# EAGLE design quad_sensor_adapter (EAGLE 9.0.0)
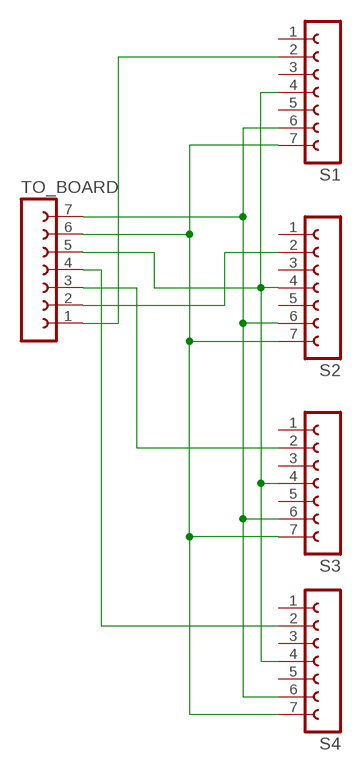
[diagram p0: schematic, sheet 1]

## Parts
S1  FE07-1  [FE07]
S2  FE07-1  [FE07]
S3  FE07-1  [FE07]
S4  FE07-1  [FE07]
TO_BOARD  FE07-1  [FE07]

## Nets
GRND: S1.7 S2.7 S3.7 S4.7 TO_BOARD.6
N$1: S4.2 TO_BOARD.4
PWR: S1.6 S2.6 S3.6 S4.6 TO_BOARD.7
RX1: S1.2 TO_BOARD.1
RX2: S2.2 TO_BOARD.2
RX3: S3.2 TO_BOARD.3
S3: S1.4 S2.4 S3.4 S4.4 TO_BOARD.5
Unconnected: S1.1 S1.3 S1.5 S2.1 S2.3 S2.5 S3.1 S3.3 S3.5 S4.1 S4.3 S4.5

## Library data of the parts
S1-S4 TO_BOARD = con-lsta:FE07-1: FEMALE HEADER; OC_FARNELL: unknown; OC_NEWARK: unknown

## Board
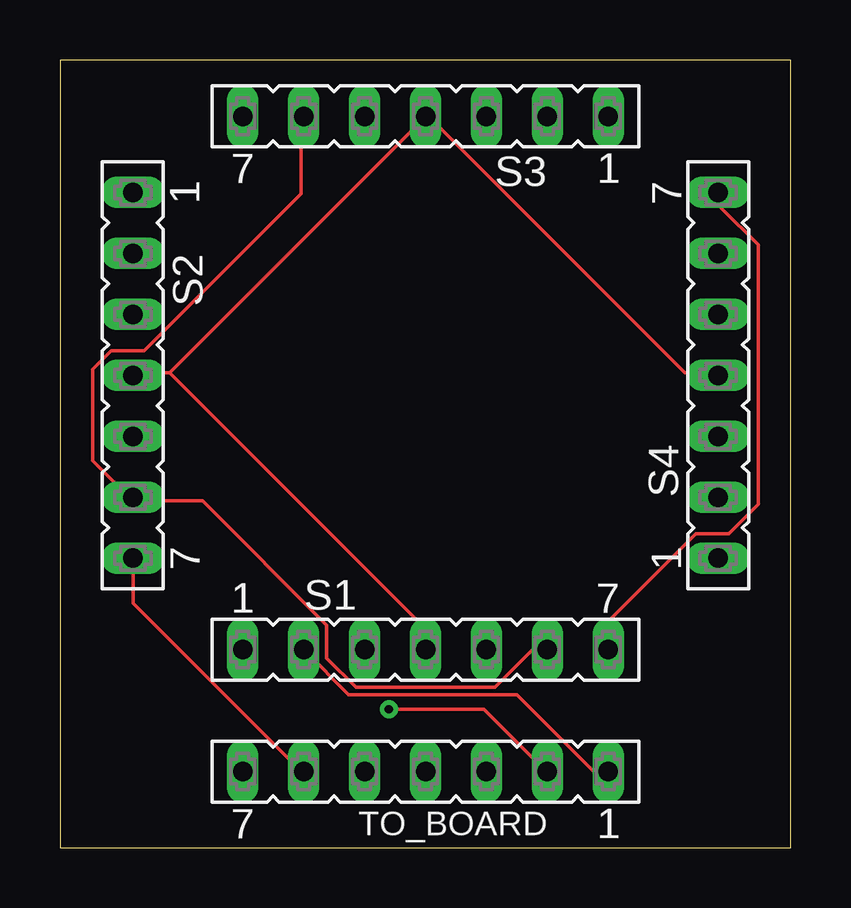
[diagram p1: board, top side]
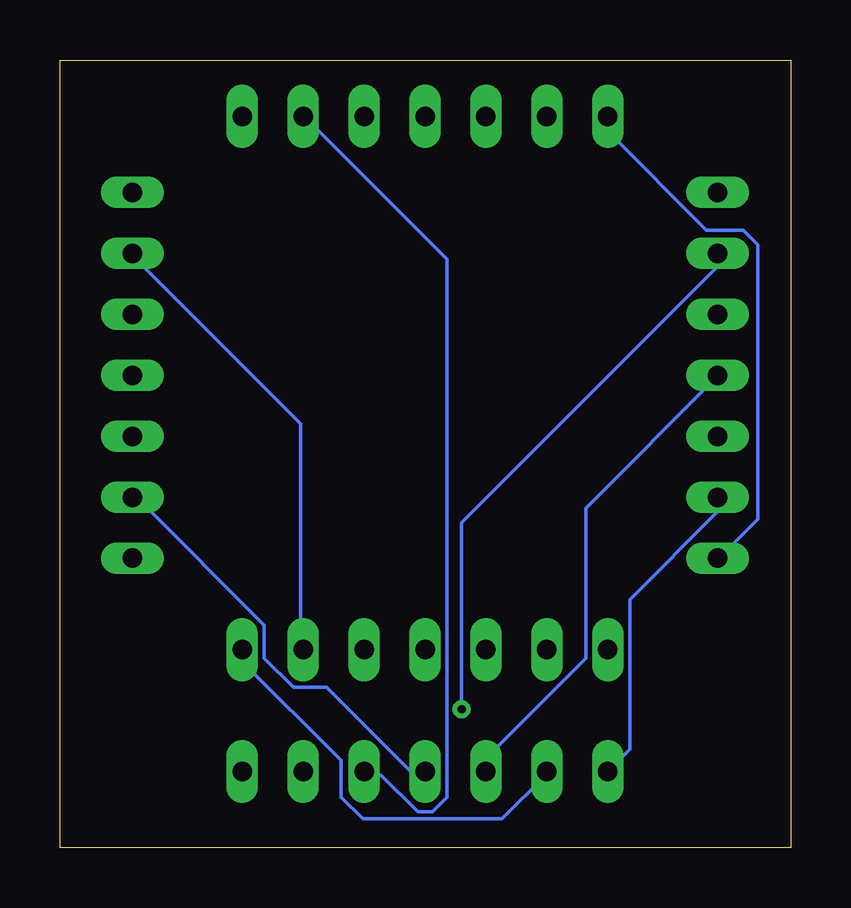
[diagram p2: board, bottom side, seen from below]

Size 30.46 x 32.82 mm. Coordinates in mm from the lower left corner, seen from the top.
Outline: 0,0 30.46,0 30.46,32.82 0,32.82 0,0
Copper layers (1*16): Top 0.035mm / dielectric 1.5mm / Bottom 0.035mm
Design rules "default": minimum track width 6mil, minimum drill 0.35mm, track to track 6mil, track to pad 6mil, pad to pad 6mil, via to via 6mil, smd to smd 6mil, copper to edge 40mil, drill to drill 6mil, minimum pad ring 10mil, minimum via ring 8mil, stop-mask expansion 4mil, vias tented up to drill 0mil, thermal gap 10mil

### Footprints (pad centres in the part's own frame; a part is rotated, then mirrored left to right if it is on the bottom)
FE07 = drill 0.813 long: 1 -7.62,0; 2 -5.08,0; 3 -2.54,0; 4 0,0; 5 2.54,0; 6 5.08,0; 7 7.62,0

### Placement (x,y rotation side)
S1  15.24,8.25 0 top
S2  3.04,19.69 270 top
S3  15.24,30.48 180 top
S4  27.44,19.69 90 top
TO_BOARD  15.24,3.17 180 top

### Tracks (layer width: path | path; a pad name or v marks a point on that pad's centre or on a via)
GRND
  Top 0.152: S2.7 3.05,12.02 3.05,10.19 10.06,3.18 TO_BOARD.6 | S4.7 27.58,27.26 27.58,26.65 29.11,25.13 29.11,14.31 27.89,13.09 26.51,13.09 23.01,9.58 23.01,8.37 S1.7
  Bottom 0.152: S3.7 7.62,30.46 7.62,29.85 3.5,25.74 1.98,25.74 1.37,25.13 1.37,13.7 2.89,12.17 S2.7 | S1.7 22.86,8.21 22.86,7.75 18.74,3.64 18.74,2.12 17.83,1.2 12.04,1.2 10.21,3.03 TO_BOARD.6
N$1
  Bottom 0.152: TO_BOARD.4 15.39,3.18 15.85,3.18 19.35,6.69 20.72,6.69 21.94,7.91 21.94,9.28 27.12,14.46 27.43,14.46 S4.2
PWR
  Top 0.152: S3.6 10.06,30.46 10.06,27.26 3.5,20.71 2.13,20.71 1.37,19.95 1.37,16.14 2.89,14.61 S2.6 3.05,14.46 5.94,14.46 11.12,9.28 11.12,7.91 12.34,6.69 18.13,6.69 19.66,8.21 20.27,8.21 S1.6
  Bottom 0.152: S1.6 20.42,8.37 20.42,17.66 27.43,24.67 S4.6 | S2.6 3.05,14.46 3.05,14 6.7,10.35 6.7,4.1 TO_BOARD.7
RX1
  Top 0.152: TO_BOARD.1 22.25,3.18 19.05,6.38 12.04,6.38 10.21,8.21 S1.2
RX2  (via drill 0.35)
  Top 0.152: v13.71,5.77 17.68,5.77 20.27,3.18 TO_BOARD.2
  Bottom 0.152: v13.71,5.77 13.71,13.55 3.05,24.21 3.05,24.67 S2.2
RX3
  Bottom 0.152: TO_BOARD.3 17.68,3.03 17.07,3.03 15.54,1.51 14.93,1.51 14.32,2.12 14.32,24.52 20.27,30.46 S3.2
S3
  Top 0.152: 4.57,19.8 3.05,19.8 S2.4 | 4.57,19.8 15.24,30.46 S3.4 15.39,30.46 26.06,19.8 27.43,19.8 S4.4 | 4.57,19.8 15.24,9.13 15.24,8.37 S1.4
  Bottom 0.152: TO_BOARD.5 12.65,3.18 12.65,3.79 8.53,7.91 8.53,14.16 3.05,19.64 S2.4